# Altium project DHA-3v15.PrjPcb (part 2 of 3)

## Sheet PW.SchDoc
size A4; SheetNumber: 5; SheetTotal: 15
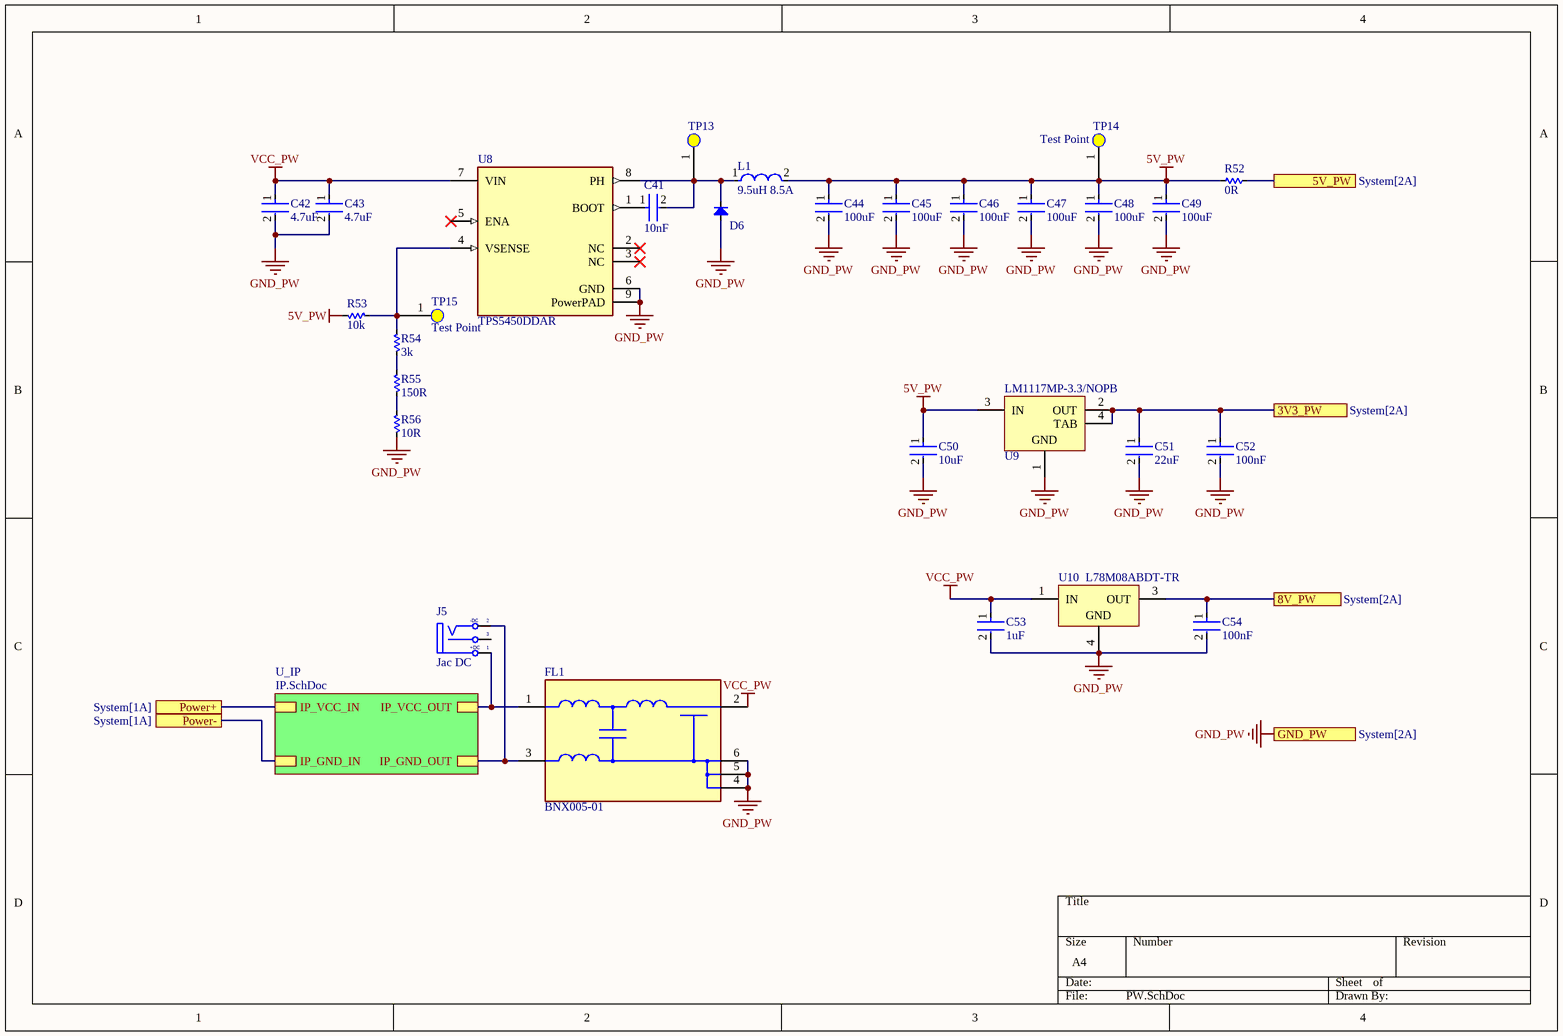
[diagram p6: PW.SchDoc]

### Parts
C41  10nF  [FP-GRM21B-0_1-IPC_A]
C42  4.7uF  [FP-C1210C107M9PACTU-IPC_A]
C43  4.7uF  [FP-C1210C107M9PACTU-IPC_A]
C44  100uF  [FP-C1210C107M9PACTU-IPC_A]
C45  100uF  [FP-C1210C107M9PACTU-IPC_A]
C46  100uF  [FP-C1210C107M9PACTU-IPC_A]
C47  100uF  [FP-C1210C107M9PACTU-IPC_A]
C48  100uF  [FP-C1210C107M9PACTU-IPC_A]
C49  100uF  [FP-C1210C107M9PACTU-IPC_A]
C50  10uF  [FP-GRM21B-0_15-MFG]
C51  22uF  [FP-GRM21B-0_15-MFG]
C52  100nF  [FP-GRM21B-0_15-MFG]
C53  1uF  [FP-C1206C-EB-MFG]
C54  100nF  [FP-C0603-CJ-MFG]
D6  SS54  [DIO-SMD-B]  (value not drawn)
FL1  BNX005-01  [FP-BNX_L12MM5_W11MM5_T13M-MFG]
J5  Jac DC  [DC0]
L1  9.5uH 8.5A  [CDEP147NP]
R52  0R  [RES-SMD-0805]
R53  10k  [RES-SMD-0603]
R54  3k  [RES-SMD-0603]
R55  150R  [RES-SMD-0603]
R56  10R  [RES-SMD-0603]
TP13  Test Point  [Test Point]  (value not drawn)
TP14  Test Point  [Test Point]
TP15  Test Point  [Test Point]
U8  TPS5450DDAR  [FP-DDA0008J-MFG]
U9  LM1117MP-3.3/NOPB  [DCY0004A_M]
U10  L78M08ABDT-TR  [TO-252_N]

### Sub-sheets
U_IP = IP.SchDoc: IP_VCC_OUT, IP_VCC_IN, IP_GND_IN, IP_GND_OUT

### Ports
3V3_PW (see System[2A]), 5V_PW (see System[2A]), 8V_PW (see System[2A]), GND_PW (see System[2A]), Power+ (see System[1A]), Power- (see System[1A])

### Nets
3V3: C51.1 C52.1 U9.2(OUT) U9.4(TAB) ; port 3V3_PW
5V: R52.1 ; port 5V_PW
5V_PW: C44.1 C45.1 C46.1 C47.1 C48.1 C49.1 C50.1 L1.2 R52.2 R53.1 TP14.1(Test_Point) U9.3(IN)
8V: C54.1 U10.3(OUT) ; port 8V_PW
GND_PW: C42.2 C43.2 C44.2 C45.2 C46.2 C47.2 C48.2 C49.2 C50.2 C51.2 C52.2 C53.2 C54.2 D6.1(A) FL1.4(CG) FL1.5(CG) FL1.6(CG) R56.2 U8.6(GND) U8.9(PowerPAD) U9.1(GND) U10.4(GND) ; port GND_PW  [project net GND]
Power+: port Power+, sheet U_IP/IP_VCC_IN
VCC_PW: C42.1 C43.1 C53.1 FL1.2(CB) U8.7(VIN) U10.1(IN)
NetC41_1: C41.1 U8.1(BOOT)
NetC41_2: C41.2 D6.2(K) L1.1 TP13.1(Test_Point) U8.8(PH)
NetC59_1: FL1.1(B) J5.1(T) ; sheet U_IP/IP_VCC_OUT
NetD20_1: FL1.3(PSG) J5.2(TN) ; port Power-, sheet U_IP/IP_GND_IN, sheet U_IP/IP_GND_OUT
NetR53_2: R53.2 R54.1 TP15.1(Test_Point) U8.4(VSENSE)
NetR54_2: R54.2 R55.1
NetR55_2: R55.2 R56.1

Not connected (* = marked no-connect by the designer): J5 3(S); U8 2(NC)* 3(NC)* 5(ENA)*

### Notes on the sheet
- (in symbol DCIN) -DC; +DC

### Library data of the parts
C41 = CMP-2007-03453-2: 0805 10NF 50V; Voltage Rating (DC): 16V; Dielectric: X5R; Tolerance: 10%; Capacitance: 10uF; Material: Ceramic; Radiation Hardening: No; Thickness: 0.053inch; Lead Free: Lead Free; Package Quantity: 1; Width: 1.25mm; Case Code (Imperial): 0805; Depth: 1.25mm; Packaging: Tape and Reel; Max Operating Temperature: 85°C; Voltage Rating: 16V; Voltage: 16V; Height: 1.25mm; Case Code (Metric): 2012; Mount: Surface Mount; Case/Package: 0805; REACH SVHC: No SVHC; Length: 2mm; Min Operating Temperature: -55°C; Termination: SMD/SMT
C42 C43 = CMP-2000-06018-2: Tụ 4.7uF 1210 50V 10%; Voltage Rating (DC): 6.3V; Capacitance: 100uF; Dissipation Factor: 5%; Dielectric: X5R; Dielectric Material: Ceramic; Tolerance: 20%; Termination: SMD/SMT; REACH SVHC: No SVHC; Thickness: 0.11inch; Packaging: Tape and Reel; Series: C; Width: 2.5mm; Voltage: 6.3V; Contact Plating: Tin; Package Quantity: 1; Case/Package: 1210; Min Operating Temperature: -55°C; Height: 2.5mm; Radiation Hardening: No; Case Code (Metric): 3225; Depth: 2.5mm; Construction: Flat; Max Operating Temperature: 85°C; Number of Pins: 2; Mount: Surface Mount; Lead Free: Lead Free; RoHS Compliant: Yes; Voltage Rating: 6.3V; Length: 3.2mm; Case Code (Imperial): 1210
  C42: ComponentLink1Description: New link; ComponentLink1URL: https://linhkien.cxtvn.com/3437-tu-1210-khong-phan-cuc.html
C44-C49 = CMP-2000-06018-2: SMD 1210 100UF 107K 3225 25V 20% X5R; Voltage Rating (DC): 6.3V; Dissipation Factor: 5%; Dielectric Material: Ceramic; Termination: SMD/SMT; REACH SVHC: No SVHC; Thickness: 0.11inch; Packaging: Tape and Reel; Series: C; Width: 2.5mm; Voltage: 6.3V; Contact Plating: Tin; Package Quantity: 1; Case/Package: 1210; Min Operating Temperature: -55°C; Height: 2.5mm; Radiation Hardening: No; Capacitance: 100uF; Case Code (Metric): 3225; Depth: 2.5mm; Construction: Flat; Max Operating Temperature: 85°C; Number of Pins: 2; Mount: Surface Mount; Lead Free: Lead Free; RoHS Compliant: Yes; Voltage Rating: 6.3V; Dielectric: X5R; Length: 3.2mm; Case Code (Imperial): 1210; Tolerance: 20%
  C44: ComponentLink1Description: New link; ComponentLink1URL: https://cungcaplinhkien.vn/tu-gom-smd-1210-100uf-107k-3225-25v-20-x5r
C50 C52 = CMP-2007-03385-2: Cap 0805 10%; Material: Ceramic; Voltage: 6.3V; Dielectric: X5R; Tolerance: 20%; Capacitance: 22uF; Max Operating Temperature: 85°C; Min Operating Temperature: -55°C; Case/Package: 0805; Thickness: 0.053inch; Packaging: Tape and Reel; Depth: 1.25mm; Termination: SMD/SMT; Voltage Rating (DC): 6.3V; Radiation Hardening: No; Mount: Surface Mount; Lead Free: Lead Free; Package Quantity: 1; REACH SVHC: No SVHC; Voltage Rating: 6.3V; Length: 2mm; Case Code (Imperial): 0805; Case Code (Metric): 2012; Width: 0.049inch; Height: 1.25mm
C51 = CMP-2007-03385-2: Cap 0805 10%; Material: Ceramic; Voltage: 6.3V; Dielectric: X5R; Tolerance: 20%; Max Operating Temperature: 85°C; Min Operating Temperature: -55°C; Case/Package: 0805; Thickness: 0.053inch; Packaging: Tape and Reel; Depth: 1.25mm; Termination: SMD/SMT; Voltage Rating (DC): 6.3V; Radiation Hardening: No; Mount: Surface Mount; Lead Free: Lead Free; Package Quantity: 1; REACH SVHC: No SVHC; Voltage Rating: 6.3V; Capacitance: 22uF; Length: 2mm; Case Code (Imperial): 0805; Case Code (Metric): 2012; Width: 0.049inch; Height: 1.25mm
C53 = CMP-03020-000153-1: CAP CER 0.1UF 100V X7R 1206; Manufacturer: KEMET; Manufacturer Part Number: C1206C104K1RACTU; Value: 0.10 μF; Tolerance: 0.1; Material: Ceramic; Temperature Coefficient: 15%; Automotive Grade: Grade 0; Voltage Rating: 100 V; Automotive: Yes; Ipc Land Pattern Name: CAPC320160X78; Device Class L1: Passive Components; ComponentLink2Description: Datasheet; Temperature Range Low: -55°C; Category: Cap; Octopart: https://octopart.com/c1206c104k1ractu-kemet-89521; Height: 0.88mm; Lead Free: Yes; Digikey Description: CAP CER 0.1UF 100V X7R 1206; Mouser Description: CAP CER 0.1UF 100V X7R 1206; Device Class L3: Ceramic Capacitors; Device Class L2: Capacitors; ComponentLink2URL: https://content.kemet.com/datasheets/KEM_C1007_X8R_ULTRA_150C_SMD.pdf; Temperature Range High: +150°C; Temperature Characteristic: X7R; RoHS: TRUE; Capacitance: 0.10 μF; Package: C1206C-EB; Temperature: -55°C to +150°C
C54 = CMP-2006-03300-2: CAP CER 0.1UF 50V X7R 0603; Manufacturer Part Number: C0603X104K5RACTU; Manufacturer: Kemet; Material: Ceramic; Tolerance: 10%; Temperature Coefficient: 15%; Temperature Range High: +125°C; Temperature Range Low: -55°C; Voltage: 50V; ComponentLink2Description: Datasheet; RoHS: TRUE; ComponentLink2URL: https://content.kemet.com/datasheets/KEM_C1013_X7R_FT-CAP_SMD.pdf; Capacitance: 100nF; Device Class L3: Ceramic Capacitors; Device Class L2: Capacitors; Package: C0603-CJ; Height: 0.95mm; Device Class L1: Passive Components; Temperature Characteristic: X7R; Lead Free: Yes; Digikey Description: CAP CER 0.1UF 50V X7R 0603; Automotive: No; Value: 100nF; Mouser Description: Capacitor; Ceramic; Cap 0.1uF; Tol+10%; SMT; Flexible Termination; Vol-Rtg 50V; TR; Temperature: -55°C to +125°C; Octopart: https://octopart.com/c0603x104k5ractu-kemet-9145062; Category: Cap; Voltage Rating: 50V; Ipc Land Pattern Name: CAPC16080X80
D6 = Diode SMD: SMB; Code - JEDEC: DO-214-AB; Value: 1N5007; Published: 8-Jun-2000; Revision: July-2002: Re-released for DXP Platform.; Publisher: Altium Limited
FL1 = CMP-06051-000064-1: BNX005-01 FILTER LC TH 12x11mm; Max Current Rating: 15A; Voltage Rating: 50V; Number of Channels: 2; Attenuation Value: 40dB; Frequency: 1GHz; Impedance: 50R; Shielding: Unshielded; ESD Protection: No; Height: 13.5mm; Circuit Type: Filter; Package Quantity: 100; Radiation Hardening: No; Max Operating Temperature: 85°C; Packaging: Bulk; Current Rating: 15A; Width: 11mm; REACH SVHC: No SVHC; Mount: Through Hole; Depth: 11mm; Termination: PC Pins; Current: 15A; Contact Plating: Copper; Min Operating Temperature: -30°C; Max Voltage Rating (DC): 50V; Length: 12mm; Lead Free: Lead Free; ComponentLink1Description: New link; ComponentLink1URL: https://linhkien.cxtvn.com/10042-bnx005-01-filter-lc-th-12x11mm.html
J5 = DCIN: Jac DC input; Value: Jac DC
L1 = CDEP147NP: CEPD147NP-9R5MC Cuộn cảm 9.5uH 8.5A 14.5x14.5x8mm; ComponentLink1Description: New link; ComponentLink1URL: https://linhkien.cxtvn.com/10665-cepd147np-9r5mc-cuon-cam-95uh-85a-145x145x8mm.html
R52 = Res-SMD: Res 0805 1%; Manufacturer: Generic Components; Class: Passive; Published: 08/06/2000; Publisher: Altium Hobart Technology Centre
R53-R56 = Res-SMD: Res 0603 5%; Manufacturer: Generic Components; Class: Passive; Published: 08/06/2000; Publisher: Altium Hobart Technology Centre
U8 = CMP-04918-000100-1: TPS5450DDAR IC Reg Buck Adjustable 5A 8-PowerSOIC; Manufacturer: Texas Instruments; Output Type: AdjustableProgrammable; Output Voltage: 1.22-31V; Max Duty Cycle: 89%; Min Supply Voltage: 5.5V; Standoff Height: 0mm; Max Junction Temp: +125°C; Max Supply Voltage: 36V; Nominal Supply Current: 3mA; Number Of Outputs: 1; Switching Frequency: 500kHz; Device Class L3: Voltage Regulators - Switching; Octopart: https://octopart.com/tps5450ddar-texas+instruments-7105511; Temperature: -40°C to +125°C; Mouser Description: Conv DC-DC 5.5V to 36V Step Down Single-Out 1.22V to 31V 5A 8-Pin HSOP EP T/R; Device Class L1: Integrated Circuits (ICs); Automotive: No; Package: DDA0008J; Temperature Range Low: -40°C; RoHS: TRUE; Digikey Description: IC REG BUCK ADJUSTABLE 5A 8SOPWR; Lead Free: Yes; Manufacturer Part Number: TPS5450DDAR; Device Class L2: Power Management ICs; Temperature Range High: +125°C; Output Current: 5A; Height: 1.7mm; Ipc Land Pattern Name: SOIC127P600X170-8; Category: IC; Switching Topology: Buck; ComponentLink3Description: New link; ComponentLink3URL: https://linhkien.cxtvn.com/5009-tps5450ddar-ic-reg-buck-adjustable-5a-8-powersoic.html
U9 = CMP-0062-01638-4: 800mA Low-Dropout Linear Regulator, 4-pin SOT-223, Pb-Free; Manufacturer: Texas Instruments; CompType: LDO IC; PackageTopMarking: XYTT*N05A; High-Reliability: Y; PowerWise: N; ComponentLink1URL: http://www.ti.com/general/docs/lit/getliterature.tsp?genericPartNumber=LM1117-N&fileType=pdf; PinCount: 4; PackageDescription: Molded SOT-223, 6.50 x 3.56 x 1.6mm Body, 4 Lead, 2.3mm Pitch; Code_IPC: SOT223-4; PartNumber: LM1117MP-3.3/NOPB; Code_JEDEC: TO-261-AA; RoHS: Y; PackageReference: DCY0004A; ComponentLink1Description: Datasheet URL
U10 = CMP-0244-00195-1: Precision 500mA Regulator, 8V, 3-Pin DPAK, Tape and Reel; PackageVersion: 2011; ComponentLink1URL: http://www.st.com; ComponentLink1Description: Manufacturer URL; PackageDescription: 3-Pin Transistor Outline Package 2.28 mm Pitch, 9.7 mm Lead Span (DPAK); ComponentLink2URL: http://www.st.com/internet/com/TECHNICAL_RESOURCES/TECHNICAL_LITERATURE/DATASHEET/CD00000448.pdf; DatasheetVersion: 1/11/2010; PackageReference: TO-252; ComponentLink2Description: Datasheet

## Sheet IP.SchDoc
size A4; SheetNumber: 6; SheetTotal: 14
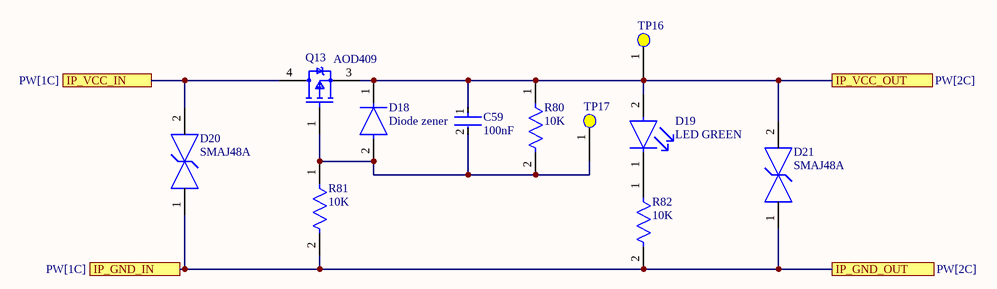
[diagram p7: IP.SchDoc]

### Parts
C59  100nF  [FP-GRM18-0_15-MFG]
D18  Diode zener  [FP-DO-213AA-MFG]
D19  LED GREEN  [FP-LTST-C190GKT-MFG]
D20  SMAJ48A  [FP-SMAJ-MFG]
D21  SMAJ48A  [FP-SMAJ-MFG]
Q13  AOD409  [FP-PG-TO252-3-MFG]
R80  10K  [FP-RC0603-0_55-IPC_A]
R81  10K  [FP-RC0603-0_55-IPC_C]
R82  10K  [FP-RC0603-0_55-IPC_C]
TP16  Test Point  [Test Point]  (value not drawn)
TP17  Test Point  [Test Point]  (value not drawn)

### Ports
IP_GND_IN (see PW[1C]), IP_GND_OUT (see PW[2C]), IP_VCC_IN (see PW[1C]), IP_VCC_OUT (see PW[2C])

### Nets
Power+: D20.2 Q13.4(D) ; port IP_VCC_IN
NetC59_1: C59.1 D18.1(C) D19.2(A) D21.2 Q13.3(S) R80.1 TP16.1(Test_Point) ; port IP_VCC_OUT
NetC59_2: C59.2 D18.2(A) Q13.1(G) R80.2 R81.1 TP17.1(Test_Point)
NetD19_1: D19.1(C) R82.1
NetD20_1: D20.1 D21.1 R81.2 R82.2 ; port IP_GND_IN, port IP_GND_OUT

### Library data of the parts
C59 = CMP-2000-05448-2: CAP CER 10V X5R 0603; Manufacturer Part Number: GRM188R61A106KE69D; Manufacturer: Murata; Temperature Coefficient: 15%; Value: 10uF; Material: Ceramic; Tolerance: 10%; Device Class L1: Passive Components; ComponentLink2Description: Datasheet; Height: 0.95mm; Package: GRM18-0.15; Octopart: https://octopart.com/grm188r61a106ke69d-murata-22851381; Digikey Description: CAP CER 10UF 10V X5R 0603; Temperature Range High: +85°C; Temperature Range Low: -55°C; Temperature Characteristic: X5R; Capacitance: 10uF; RoHS: TRUE; Device Class L2: Capacitors; ComponentLink2URL: https://search.murata.co.jp/Ceramy/image/img/A01X/G101/ENG/GRM188R61A106KE69-01A.pdf; Device Class L3: Ceramic Capacitors; Lead Free: Yes; Mouser Description: Multilayer Ceramic Capacitors MLCC - SMD/SMT 0603 10uF 10volts X5R + - 10%; Category: Cap; Voltage Rating: 10V; Temperature: -55°C to +85°C; Automotive: No
D18 = CMP-2000-07607-2: ZMM12 Diode zener 0.5W 12V SOD-80(1206); Manufacturer Part Number: JANTX1N4148UR-1; Manufacturer: Microsemi; Max Junction Temp: +175°C; Max Repetitive Reverse Voltage: 75V; Value: 4pF; Reverse Voltage: 100V; Forward Current: 200mA; Max Surge Forward Current: 2A; Temperature: -65°C to +175°C; Device Class L2: Diodes; Capacitance: 4pF; Octopart: https://octopart.com/jantx1n4148ur-1-microsemi-6804654; Height: 1.7mm; Automotive: No; Digikey Description: DIODE GEN PURP 75V 200MA DO213AA; Device Class L1: Discrete Semiconductors; Package: DO-213AA; Category: Diode; ComponentLink2URL: https://www.microsemi.com/document-portal/doc_download/125215-lds-0281-1-datasheet; Device Class L3: Rectifier Diodes; Temperature Range Low: -65°C; Temperature Range High: +175°C; Mouser Description: Diodes - General Purpose, Power, Switching Switching; RoHS: FALSE; Lead Free: No; ComponentLink2Description: Datasheet
D19 = CMP-22017-000005-2: LED GREEN CLEAR CHIP SMD; Dominant Wavelength: 569nm; Reverse Voltage: 5V; Lens Color: Colorless; Viewing Angle: 130°; Voltage: 2V; Forward Current: 30mA; Power Dissipation: 100mW; Luminous Intensity: 6mcd; Number of LEDs: 1; Forward Voltage: 2.1V; Wavelength: 565nm; Test Current: 10mA; Min Operating Temperature: -55°C; Lens Style: Clear; Mount: Surface Mount; Width: 0.8mm; Packaging: Tape and Reel; Lens Transparency: Clear; Case Code (Metric): 1608; Depth: 0.8mm; Case Code (Imperial): 0603; Case/Package: 0603; Number of Pins: 2; Max Operating Temperature: 85°C; Lead Free: Lead Free; Number of Elements: 1; Length: 1.6mm; Height: 0.8mm; Package Quantity: 1; Power Rating: 100mW; Radiation Hardening: No; Illumination Color: Green; Color: Green
D20 D21 = CMP-08607-000067-1: SMAJ48A TVS DIODE 48VWM 77.4VC DO214AC (SMA); Manufacturer: Littelfuse Inc; Manufacturer Part Number: SMAJ58CA; Reverse Standoff Voltage: 58V; Breakdown Voltage: 64.4V; Peak Pulse Current: 4.3A; Peak Pulse Power: 400W; Direction: Bidirectional; Clamping Voltage: 93.6V; Number Of Channels: 1; Max Junction Temp: +150°C; Device Class L2: TVS Diodes; ComponentLink2Description: Datasheet; Lead Free: Yes; Height: 2.29mm; Automotive: No; Package: SMAJ; Digikey Description: TVS DIODE 58V 93.6V DO214AC; Temperature Range Low: -65°C; Device Class L1: Circuit Protection; Temperature Range High: +150°C; Mouser Description: In a Pack of 25, Littelfuse SMAJ58CA, Bi-Directional TVS Diode, 400W, 2-Pin DO-214AC; Octopart: https://octopart.com/smaj58ca-littelfuse-350202; ComponentLink2URL: https://www.littelfuse.com/~/media/electronics/datasheets/tvs_diodes/littelfuse_tvs_diode_smaj_datasheet.pdf.pdf; Temperature: -65°C to +150°C; Device Class L3: unset; Category: Diode; RoHS: TRUE
Q13 = CMP-32901-000090-1: AOD409 MOSFET P-CH 60V 26A TO252; Manufacturer: Infineon; Manufacturer Part Number: IRFR5410TRPBF; Threshold Vgs Min: -2V; Pulse Drain Current: -52A; Max Junction Temp: +150°C; Drain To Source Voltage: -100V; Max Forward Diode Voltage: -1.6V; Power Dissipation: 66W; Turn On Delay Time: 15ns; Input Capacitace At Vds: 760pF @ -25V; Rthja Max: 50°C/W; Depletion Mode: False; Number Of P Channels: 1; Reverse Recovery Time: 130ns; Continuous Drain Current: -13A; Drain To Source Resistance: 0.205Ω; Threshold Vgs Max: -4V; Reverse Recovery Charge: 650nC; Gate To Source Voltage: 20V; Gate Charge At Vgs: 58nC @ -10V; Turn Off Delay Time: 45ns; Temperature: -55°C to +150°C; Package: PG-TO252-3; Category: Trans; Footprint Url: http://www.irf.com/package/hexfet/dpakfootprint.pdf; Temperature Range Low: -55°C; Temperature Range High: +150°C; Automotive: No; Device Class L3: MOSFETs; Digikey Description: MOSFET P-CH 100V 13A DPAK; ComponentLink2URL: https://www.infineon.com/dgdl/irfr5410pbf.pdf?fileId=5546d462533600a4015356356f622107; Octopart: https://octopart.com/irfr5410trpbf-infineon-65874169; Device Class L2: Transistors; Lead Free: Yes; ComponentLink2Description: Datasheet; Height: 2.52mm; Number Of Channels: 1; Drain To Source Breakdown Voltage: -100V; Device Class L1: Discrete Semiconductors; RoHS: TRUE
R80-R82 = CMP-2100-03664-2: RES 10K OHM 1% 1/10W 0603; Voltage Rating: 75V; Voltage Rating (DC): 50V; Resistance: 10kR; Power Rating: 100mW; Temperature Coefficient: 100ppm/°C; Depth: 0.8mm; Termination: SMD/SMT; Resistor Type: Thick Film; Series: RC; Construction: Rectangular; Features: Moisture Resistant; Packaging: Tape and Reel; Min Operating Temperature: -55°C; Number of Terminations: 2; Lead Pitch: 0.3mm; RoHS Compliant: Yes; Case/Package: 0603; Resistance Tolerance: 1%; Military Standard: Not; Weight: 7.1E-05oz; Number of Pins: 2; Tolerance: 1%; Length: 1.6mm; Case Code (Imperial): 0603; Lead Free: Lead Free; Width: 0.8mm; Max Power Dissipation: 100mW; Height: 0.45mm; Max Operating Temperature: 155°C; Case Code (Metric): 1608; Size Code: 0603

## Sheet SIM.SchDoc
size A3; SheetNumber: 12; SheetTotal: 15
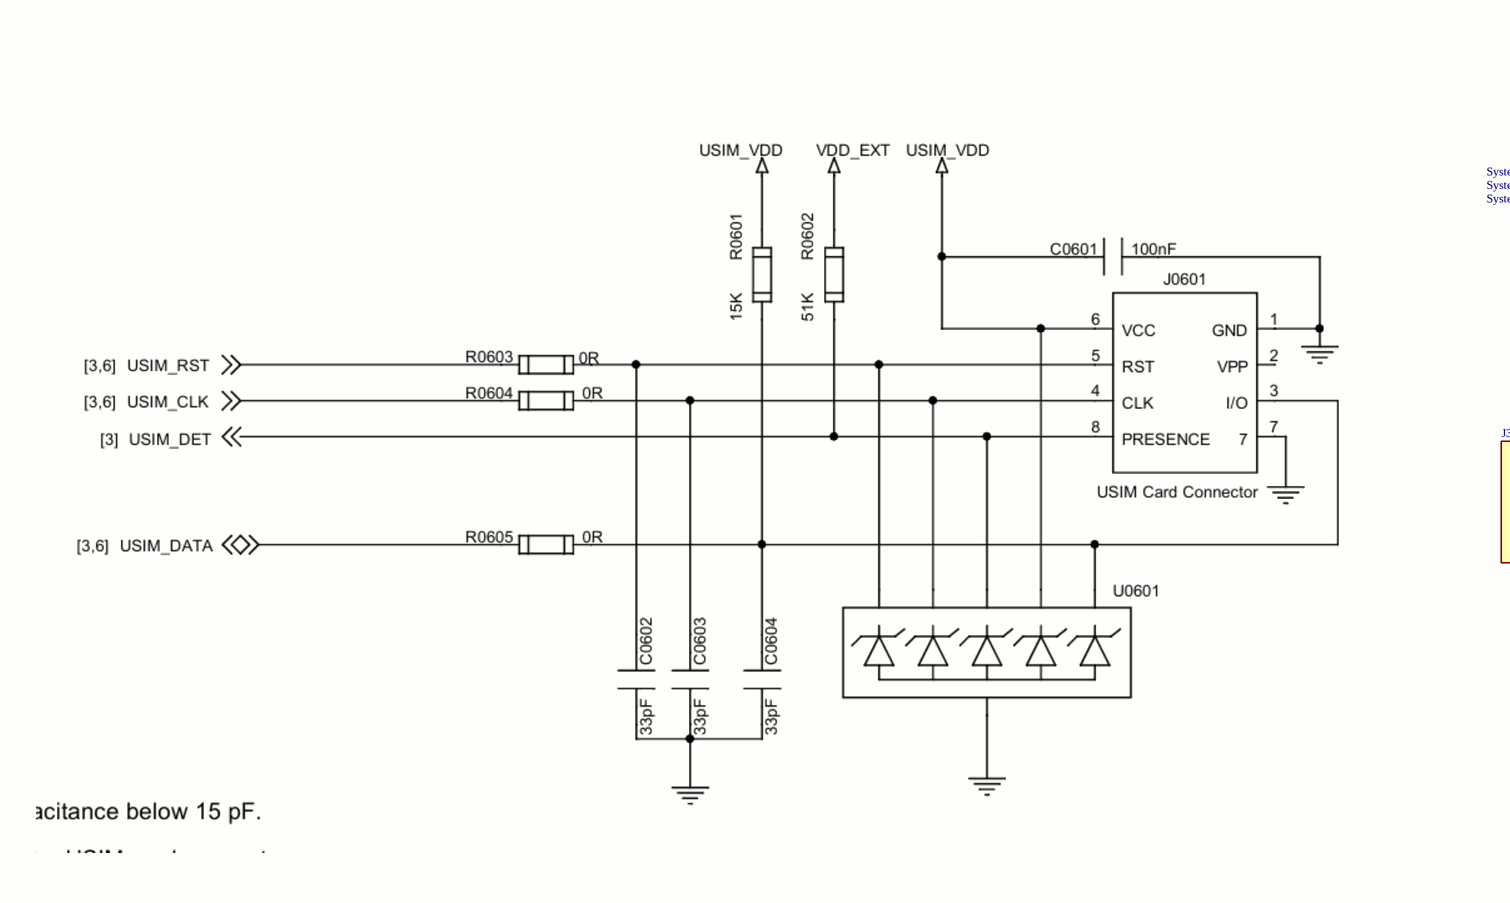
[diagram p8: SIM.SchDoc, top left]
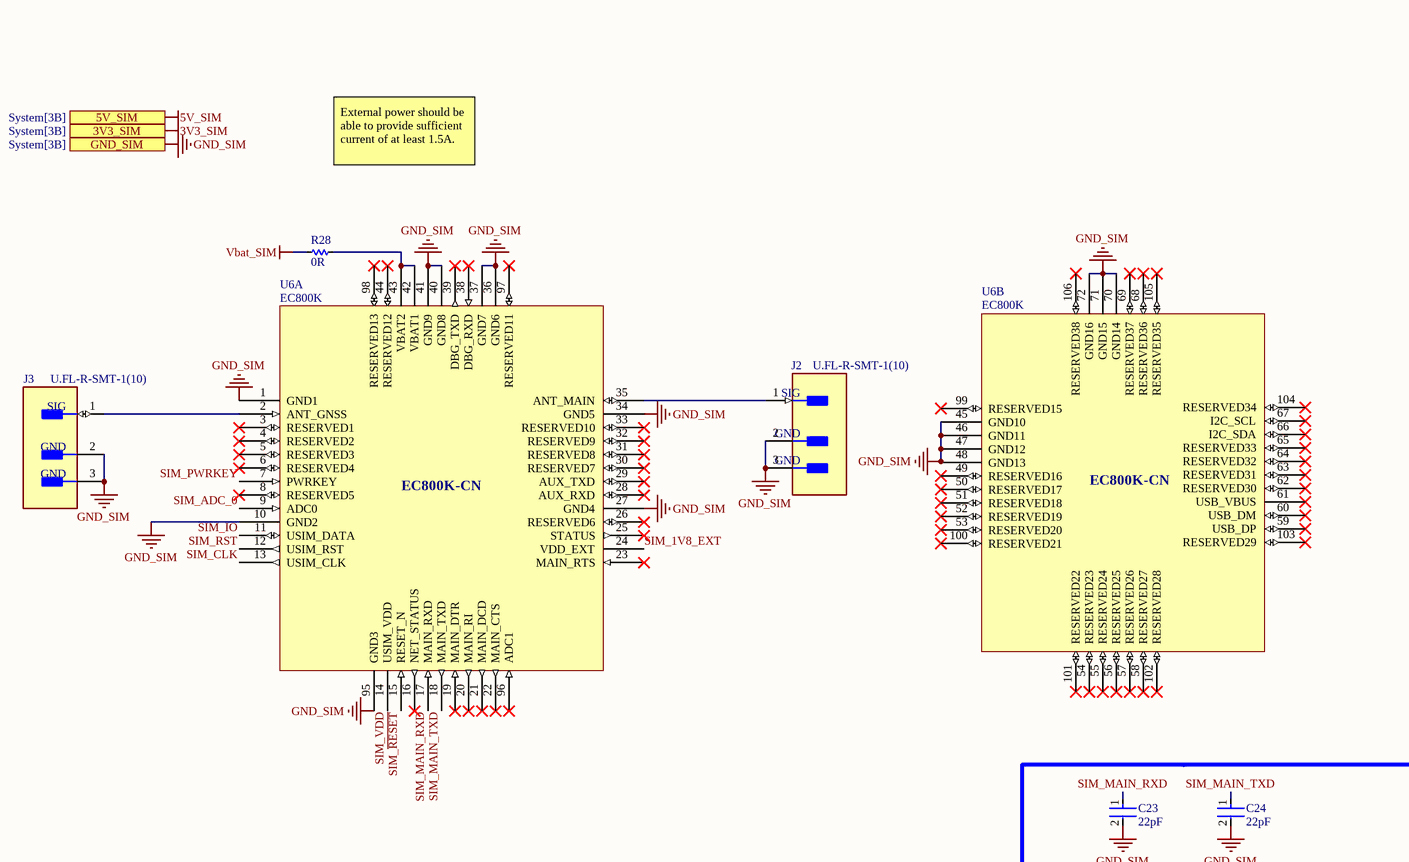
[diagram p9: SIM.SchDoc, top middle]
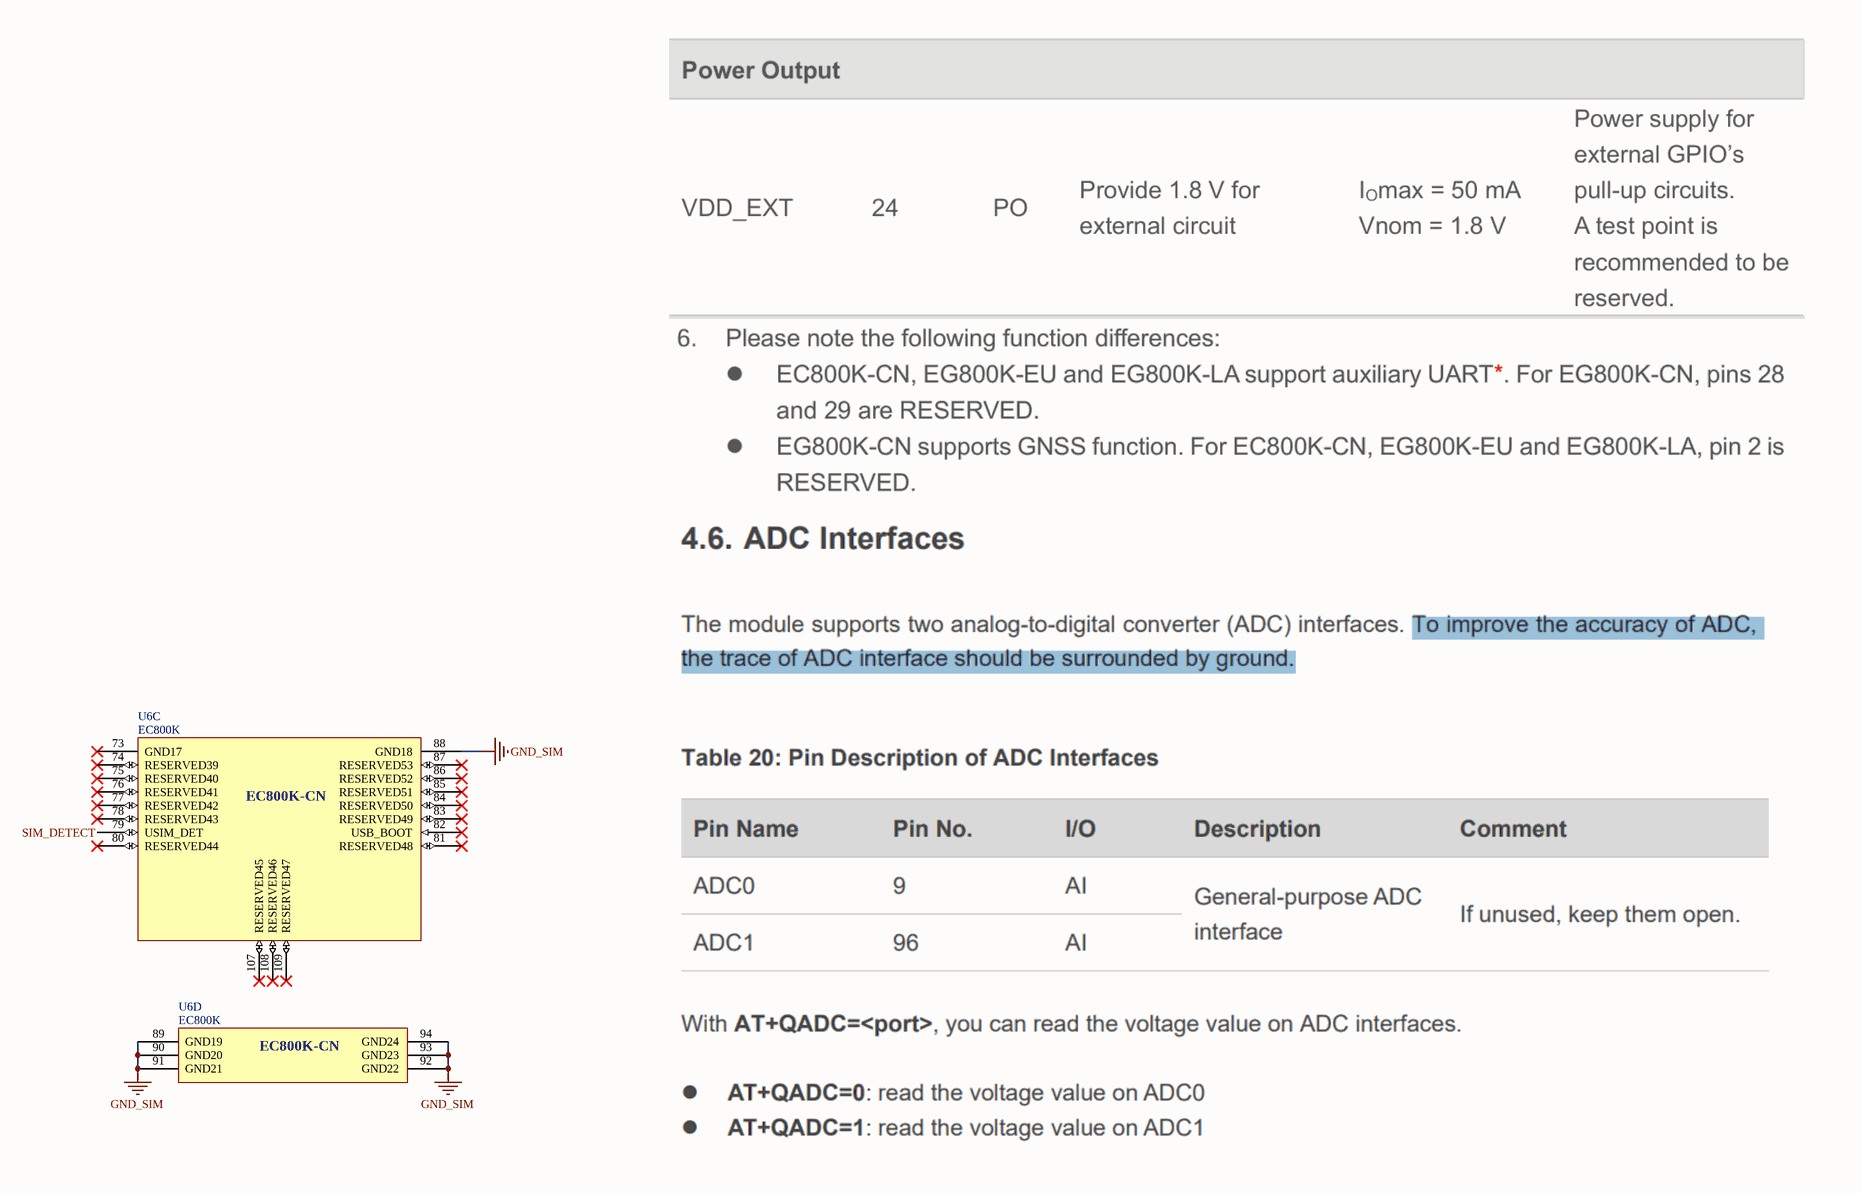
[diagram p10: SIM.SchDoc, top right]
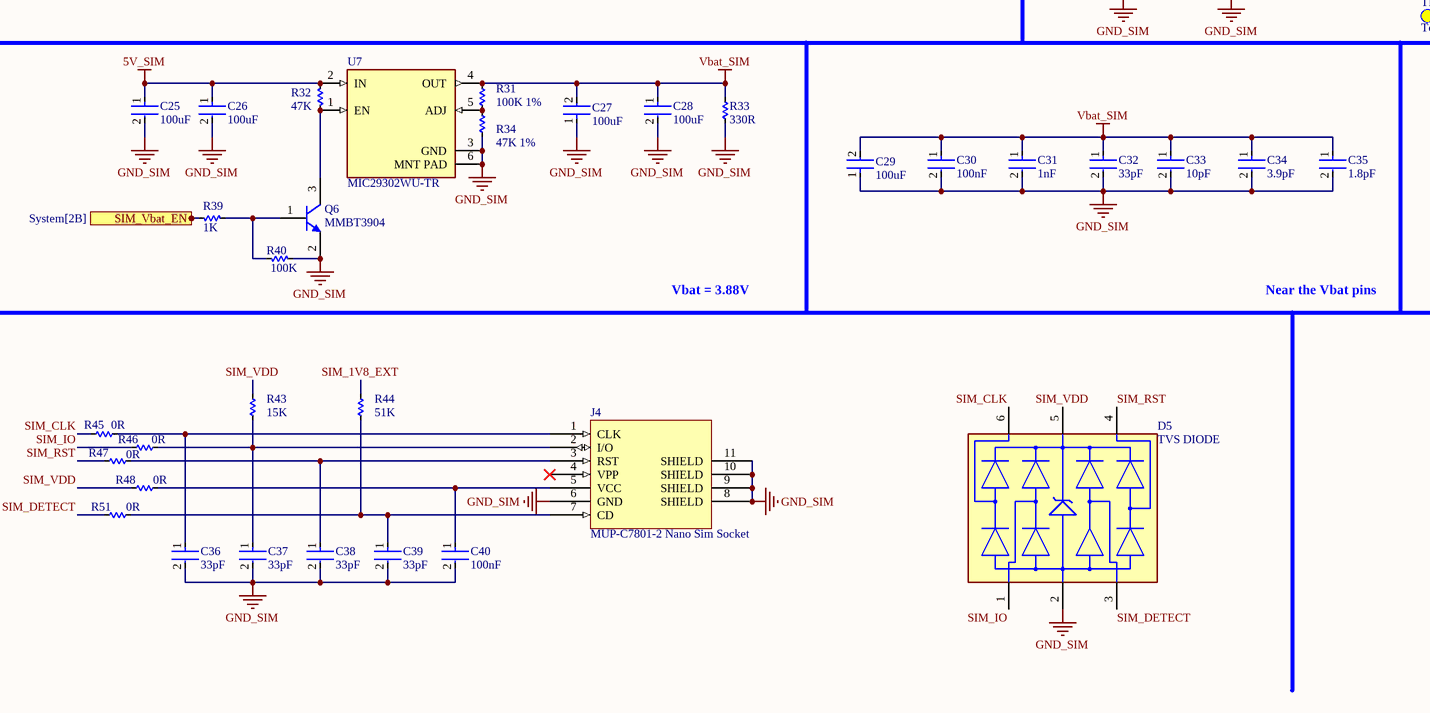
[diagram p11: SIM.SchDoc, bottom middle]
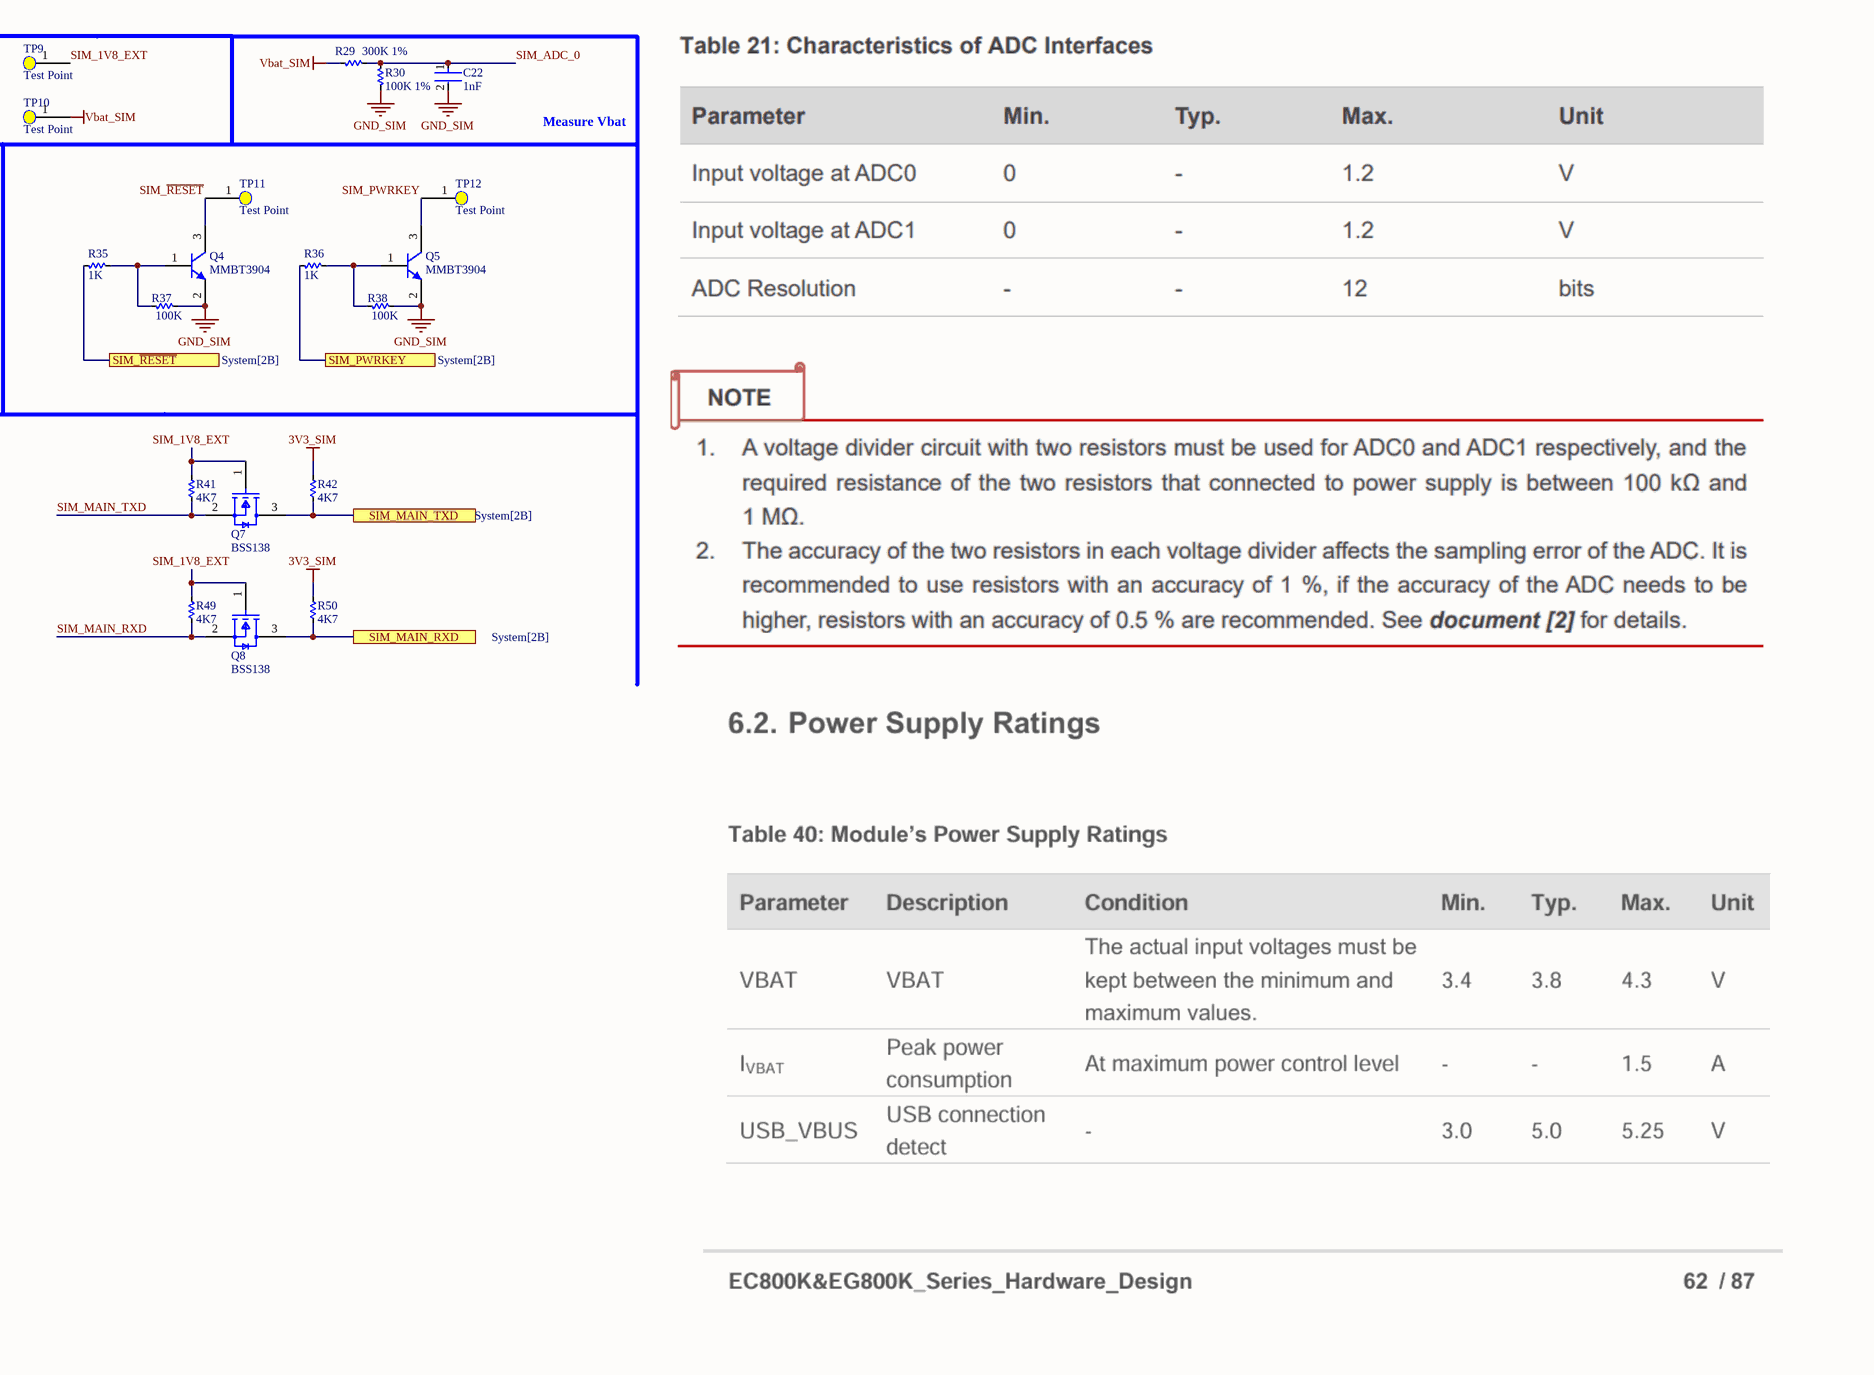
[diagram p12: SIM.SchDoc, bottom right]

### Parts
C22  1nF  [FP-GRM18-0_15-MFG]
C23  22pF  [FP-GRM188-0_1-e0_2_0_55-IPC_C]
C24  22pF  [FP-GRM188-0_1-e0_2_0_55-IPC_C]
C25  100uF  [FP-C1210C107M9PACTU-IPC_A]
C26  100uF  [FP-C1210C107M9PACTU-IPC_A]
C27  100uF  [FP-C1210C107M9PACTU-IPC_A]
C28  100uF  [FP-C1210C107M9PACTU-IPC_A]
C29  100uF  [FP-C1210C107M9PACTU-IPC_A]
C30  100nF  [FP-GRM188-0_1-e0_2_0_55-IPC_C]
C31  1nF  [FP-GRM188-0_1-e0_2_0_55-IPC_C]
C32  33pF  [FP-GRM188-0_1-e0_2_0_55-IPC_C]
C33  10pF  [FP-GRM188-0_1-e0_2_0_55-IPC_C]
C34  3.9pF  [FP-GRM188-0_1-e0_2_0_55-IPC_C]
C35  1.8pF  [FP-GRM188-0_1-e0_2_0_55-IPC_C]
C36  33pF  [FP-GRM188-0_1-e0_2_0_55-IPC_C]
C37  33pF  [FP-GRM188-0_1-e0_2_0_55-IPC_C]
C38  33pF  [FP-GRM188-0_1-e0_2_0_55-IPC_C]
C39  33pF  [FP-GRM188-0_1-e0_2_0_55-IPC_C]
C40  100nF  [FP-GRM188-0_1-e0_2_0_55-IPC_C]
D5  TVS DIODE  [FP-318G-02-MFG]
J2  U.FL-R-SMT-1(10)  [FP-U_FL-R-SMT-1_10-MFG]
J3  U.FL-R-SMT-1(10)  [FP-U_FL-R-SMT-1_10-MFG]
J4  MUP-C7801-2 Nano Sim Socket  [MCP-C7801-2]
Q4  MMBT3904  [FAIR-SOT23-3_V]
Q5  MMBT3904  [FAIR-SOT23-3_V]
Q6  MMBT3904  [FAIR-SOT23-3_V]
Q7  BSS138  [FP-318-08-IPC_B]
Q8  BSS138  [FP-318-08-IPC_B]
R28  0R  [RES-SMD-0805]
R29  300K 1%  [RES-SMD-0603]
R30  100K 1%  [RES-SMD-0603]
R31  100K 1%  [RES-SMD-0603]
R32  47K  [RES-SMD-0603]
R33  330R  [RES-SMD-0603]
R34  47K 1%  [RES-SMD-0603]
R35  1K  [RES-SMD-0603]
R36  1K  [RES-SMD-0603]
R37  100K  [RES-SMD-0603]
R38  100K  [RES-SMD-0603]
R39  1K  [RES-SMD-0603]
R40  100K  [RES-SMD-0603]
R41  4K7  [RES-SMD-0603]
R42  4K7  [RES-SMD-0603]
R43  15K  [RES-SMD-0603]
R44  51K  [RES-SMD-0603]
R45  0R  [RES-SMD-0603]
R46  0R  [RES-SMD-0603]
R47  0R  [RES-SMD-0603]
R48  0R  [RES-SMD-0603]
R49  4K7  [RES-SMD-0603]
R50  4K7  [RES-SMD-0603]
R51  0R  [RES-SMD-0603]
TP9  Test Point  [Test Point]
TP10  Test Point  [Test Point]
TP11  Test Point  [Test Point]
TP12  Test Point  [Test Point]
U6  EC800K  [EC800K]  (parts A,B,C,D of 4)
U7  MIC29302WU-TR  [FP-C04-012-MFG]

### Ports
3V3_SIM (see System[3B]), 5V_SIM (see System[3B]), GND_SIM (see System[3B]), SIM_MAIN_RXD (see System[2B]), SIM_MAIN_TXD (see System[2B]), SIM_PWRKEY (see System[2B]), SIM_Vbat_EN (see System[2B]), SIM_~{RESET} (see System[2B])

### Nets
3V3_SIM: R42.1 R50.1 ; port 3V3_SIM  [project net 3V3]
5V_SIM: C25.1 C26.1 R32.2 U7.2(IN) ; port 5V_SIM  [project net 5V]
GND_SIM: C22.2 C23.2 C24.2 C25.2 C26.2 C27.1 C28.2 C29.1 C30.2 C31.2 C32.2 C33.2 C34.2 C35.2 C36.2 C37.2 C38.2 C39.2 C40.2 D5.2(VN) J2.2(GND) J2.3(GND) J3.2(GND) J3.3(GND) J4.6(GND) J4.8(SHIELD) J4.9(SHIELD) J4.10(SHIELD) J4.11(SHIELD) Q4.2(E) Q5.2(E) Q6.2(E) R30.2 R33.2 R34.2 R37.1 R38.1 R40.1 U6.1(GND1) U6.10(GND2) U6.27(GND4) U6.34(GND5) U6.36(GND6) U6.37(GND7) U6.40(GND8) U6.41(GND9) U6.45(GND10) U6.46(GND11) U6.47(GND12) U6.48(GND13) U6.70(GND14) U6.71(GND15) U6.72(GND16) U6.88(GND18) U6.89(GND19) U6.90(GND20) U6.91(GND21) U6.92(GND22) U6.93(GND23) U6.94(GND24) U6.95(GND3) U7.3(GND) U7.6(MNT_PAD) ; port GND_SIM  [project net GND]
Vbat_SIM: C27.2 C28.1 C29.2 C30.1 C31.1 C32.1 C33.1 C34.1 C35.1 R28.2 R29.1 R31.2 R33.1 TP10.1(Test_Point) U7.4(OUT)
SIM_1V8_EXT: Q7.1(G) Q8.1(G) R41.1 R44.1 R49.1 TP9.1(Test_Point) U6.24(VDD_EXT)
SIM_ADC_0: C22.1 R29.2 R30.1 U6.9(ADC0)
SIM_CLK: D5.6(4_I/O) R45.2 U6.13(USIM_CLK)
SIM_DETECT: D5.3(2_I/O) R51.2 U6.79(USIM_DET)
SIM_IO: D5.1(1_I/O) R46.2 U6.11(USIM_DATA)
SIM_MAIN_RXD: C23.1 Q8.2(S) R49.2 U6.17(MAIN_RXD)
SIM_MAIN_TXD: C24.1 Q7.2(S) R41.2 U6.18(MAIN_TXD)
SIM_PWRKEY: Q5.3(C) TP12.1(Test_Point) U6.7(PWRKEY)
SIM_~{RESET}: Q4.3(C) TP11.1(Test_Point) U6.15(RESET_N)
SIM_RST: D5.4(3_I/O) R47.2 U6.12(USIM_RST)
SIM_VDD: D5.5(VP) R43.1 R48.2 U6.14(USIM_VDD)
NetC36_1: C36.1 J4.1(CLK) R45.1
NetC37_1: C37.1 J4.2(I/O) R43.2 R46.1
NetC38_1: C38.1 J4.3(RST) R47.1
NetC39_1: C39.1 J4.7(CD) R44.2 R51.1
NetC40_1: C40.1 J4.5(VCC) R48.1
NetJ2_1: J2.1(SIG) U6.35(ANT_MAIN)
NetJ3_1: J3.1(SIG) U6.2(ANT_GNSS)
NetQ4_1: Q4.1(B) R35.1 R37.2
NetQ5_1: Q5.1(B) R36.1 R38.2
NetQ6_1: Q6.1(B) R39.1 R40.2
NetQ6_3: Q6.3(C) R32.1 U7.1(EN)
NetQ7_3: Q7.3(D) R42.2 ; port SIM_MAIN_TXD
NetQ8_3: Q8.3(D) R50.2 ; port SIM_MAIN_RXD
NetR28_1: R28.1 U6.42(VBAT1) U6.43(VBAT2)
NetR31_1: R31.1 R34.1 U7.5(ADJ)
NetR35_2: R35.2 ; port SIM_~{RESET}
NetR36_2: R36.2 ; port SIM_PWRKEY
NetR39_2: R39.2 ; port SIM_Vbat_EN

Not connected (* = marked no-connect by the designer): J4 4(VPP)*; U6 3(RESERVED1)* 4(RESERVED2)* 5(RESERVED3)* 6(RESERVED4)* 8(RESERVED5)* 16(NET_STATUS)* 19(MAIN_DTR)* 20(MAIN_RI)* 21(MAIN_DCD)* 22(MAIN_CTS)* 23(MAIN_RTS)* 25(STATUS)* 26(RESERVED6)* 28(AUX_RXD)* 29(AUX_TXD)* 30(RESERVED7)* 31(RESERVED8)* 32(RESERVED9)* 33(RESERVED10)* 38(DBG_RXD)* 39(DBG_TXD)* 44(RESERVED12)* 49(RESERVED16)* 50(RESERVED17)* 51(RESERVED18)* 52(RESERVED19)* 53(RESERVED20)* 54(RESERVED23)* 55(RESERVED24)* 56(RESERVED25)* 57(RESERVED26)* 58(RESERVED27)* 59(USB_DP)* 60(USB_DM)* 61(USB_VBUS)* 62(RESERVED30)* 63(RESERVED31)* 64(RESERVED32)* 65(RESERVED33)* 66(I2C_SDA)* 67(I2C_SCL)* 68(RESERVED36)* 69(RESERVED37)* 73(GND17)* 74(RESERVED39)* 75(RESERVED40)* 76(RESERVED41)* 77(RESERVED42)* 78(RESERVED43)* 80(RESERVED44)* 81(RESERVED48)* 82(USB_BOOT)* 83(RESERVED49)* 84(RESERVED50)* 85(RESERVED51)* 86(RESERVED52)* 87(RESERVED53)* 96(ADC1)* 97(RESERVED11)* 98(RESERVED13)* 99(RESERVED15)* 100(RESERVED21)* 101(RESERVED22)* 102(RESERVED28)* 103(RESERVED29)* 104(RESERVED34)* 105(RESERVED35)* 106(RESERVED38)* 107(RESERVED45)* 108(RESERVED46)* 109(RESERVED47)*

### Notes on the sheet
- External power should be able to provide sufficient current of at least 1.5A.
- Measure Vbat
- Vbat = 3.88V
- Near the Vbat pins
- (in symbol EC800K, part A) EC800K-CN
- (in symbol EC800K, part B) EC800K-CN
- (in symbol EC800K, part C) EC800K-CN
- (in symbol EC800K, part D) EC800K-CN

### Library data of the parts
C22 = CMP-2000-05448-2: as C59 on sheet IP; Device Class L1: Passive Components; ComponentLink2Description: Datasheet; Height: 0.95mm; Package: GRM18-0.15; Octopart: https://octopart.com/grm188r61a106ke69d-murata-22851381; Digikey Description: CAP CER 10UF 10V X5R 0603; Temperature Range High: +85°C; Temperature Range Low: -55°C; Temperature Characteristic: X5R; Capacitance: 10uF; RoHS: TRUE; Device Class L2: Capacitors; ComponentLink2URL: https://search.murata.co.jp/Ceramy/image/img/A01X/G101/ENG/GRM188R61A106KE69-01A.pdf; Device Class L3: Ceramic Capacitors; Lead Free: Yes; Mouser Description: Multilayer Ceramic Capacitors MLCC - SMD/SMT 0603 10uF 10volts X5R + - 10%; Category: Cap; Voltage Rating: 10V; Temperature: -55°C to +85°C; Automotive: No
C23 C24 C30-C40 = CMP-2006-02792-2: Chip Multilayer Ceramic Capacitors for General Purpose, 0603, 10uF, X5R, 15%, 20%, 6.3V; Packaging: Tape and Reel; Voltage Rating (DC): 6.3V; Width: 0.031inch; Termination: SMD/SMT; Dielectric: X5R; Package Quantity: 4000; Voltage Rating: 6.3V; Capacitance: 10uF; Case/Package: 0603; Min Operating Temperature: -55°C; Voltage: 6.3V; Length: 1.6mm; Thickness: 0.035inch; Lead Free: Lead Free; Depth: 0.8mm; Case Code (Imperial): 0603; Max Operating Temperature: 85°C; Material: Ceramic; Height: 0.8mm; Tolerance: 20%; Mount: Surface Mount; REACH SVHC: No SVHC; Radiation Hardening: No; Case Code (Metric): 1608
C25-C29 = CMP-2000-06018-2: as C44 on sheet PW; Termination: SMD/SMT; REACH SVHC: No SVHC; Thickness: 0.11inch; Packaging: Tape and Reel; Series: C; Width: 2.5mm; Voltage: 6.3V; Contact Plating: Tin; Package Quantity: 1; Case/Package: 1210; Min Operating Temperature: -55°C; Height: 2.5mm; Radiation Hardening: No; Capacitance: 100uF; Case Code (Metric): 3225; Depth: 2.5mm; Construction: Flat; Max Operating Temperature: 85°C; Number of Pins: 2; Mount: Surface Mount; Lead Free: Lead Free; RoHS Compliant: Yes; Voltage Rating: 6.3V; Dielectric: X5R; Length: 3.2mm; Case Code (Imperial): 1210; Tolerance: 20%
D5 = CMP-00278-81858208-1: NSP4201MR6T1G TVS DIODE 5VWM 12VC 6TSOP; Manufacturer Lifecycle Status: ACTIVE; Direction: Unidirectional; Capacitance: 3pF; Max Junction Temperature (Tj): 125°C; Breakdown Voltage: 6V; Peak Pulse Current: 25A; Number of Channels: 4; Reverse Standoff Voltage: 5V; Peak Pulse Power: 500W; Clamping Voltage: 12V; NexarPartId: 81858208; Height: 1.1mm; Min Operating Temperature: -40°C; RoHS: Compliant; Max Operating Temperature: 125°C; Schedule B: 8536300000; Lifecycle Status: Production; ComponentLink1Description: New link; ComponentLink1URL: https://linhkien.cxtvn.com/4420-nsp4201mr6t1g-tvs-diode-5vwm-12vc-6tsop.html
J2 J3 = CMP-2000-05152-3: CONN U.FL RCPT STR 50 OHM SMD; Max Frequency: 6GHz; Connector Type: Coaxial; Body Plating: Silver; Body Material: Bronze; Impedance: 50R; Dielectric Material: Polymer; Insulation Resistance: 500MR; Gender: Male; Packaging: Cut Tape; Length: 3mm; Package Quantity: 2500; Termination: Solder; Lead Free: Lead Free; Series: U.FL; Min Operating Temperature: -40°C; Fastening Type: Snap; Contact Material: Brass; Orientation: Straight; Wire/Cable Type: Coaxial; Frequency: 6GHz; Contact Plating: Gold; Depth: 3.1mm; Weight: 0.001764oz; Max Operating Temperature: 90°C; Radiation Hardening: No; REACH SVHC: No SVHC; Mount: Surface Mount; Housing Color: Beige
Q4-Q6 = CMP-1670-00008-1: NPN General Purpose Amplifier, 40 V, 0.2 A, -55 to 150 degC, 3-Pin SOT23, RoHS, Tape and Reel; Tolerance: 30ppm; Capacitance: 1.8E-11 f; Frequency: 12.288 MHz; ESR: 40 Ohm; Load Capacitance: 18 pF; REACH SVHC: No SVHC; Pins: 4; ComponentLink3URL: http://www.fairchildsemi.com/dwg/MA/MA03D.pdf; PackageDescription: 3-Pin Small Outline Transistor, Body 2.92 x 1.325 mm, Pitch 0.95 mm; ComponentLink1URL: https://www.fairchildsemi.com/; Max Operating Temperature: 70degC; PackageReference: SOT23-3; ComponentLink1Description: Manufacturer URL; Width: 0.126 inch; Min Operating Temperature: -20degC; DatasheetVersion: Rev. 1.1.0, 10/2014; Mount: Surface Mount; Height: 0.041 inch; Package Quantity: 1000; Frequency Tolerance: 30ppm; Packaging: Tape and Reel; ComponentLink2URL: https://www.fairchildsemi.com/datasheets/MM/MMBT3904.pdf; RoHSCompliant: True; ComponentLink3Description: Package Specification; ComponentLink2Description: Datasheet; Length: 0.197 inch
Q7 Q8 = CMP-07173-000101-1: MOSFET N-CH 50V 220MA SOT-23; Turn-Off Delay Time: 20ns; Element Configuration: Single; Rds On Max: 3.5R; Gate to Source Voltage (Vgs): 20V; Threshold Voltage: 1.3V; Number of Elements: 1; Power Dissipation: 360mW; Rise Time: 9ns; Turn-On Delay Time: 2.5ns; Input Capacitance: 27pF; On-State Resistance: 6R; Lead Free: Lead Free; Length: 2.92mm; Width: 1.3mm; Drain to Source Breakdown Voltage: 50V; Min Operating Temperature: -55°C; REACH SVHC: No SVHC; Packaging: Tape and Reel; Radiation Hardening: No; Height: 0.93mm; Drain to Source Voltage (Vdss): 50V; Current Rating: 220mA; Voltage Rating (DC): 50V; Weight: 0.03g; Continuous Drain Current (ID): 220mA; Number of Pins: 3; Nominal Vgs: 1.3V; Max Power Dissipation: 360mW; Fall Time: 9ns; Drain to Source Resistance: 3.5R; Contact Plating: Tin; Case/Package: SOT-23; Package Quantity: 1; Dual Supply Voltage: 50V; Mount: Surface Mount; Termination: SMD/SMT; Max Operating Temperature: 150°C
R28 = Res-SMD: Res 0805 5%; Manufacturer: Generic Components; Class: Passive; Published: 08/06/2000; Publisher: Altium Hobart Technology Centre
R29 R30 R33 = Res-SMD: Res 0603 1%; Manufacturer: Generic Components; Class: Passive; Published: 08/06/2000; Publisher: Altium Hobart Technology Centre
R31 R32 R34-R51 = Res-SMD: as R53 on sheet PW; Published: 08/06/2000; Publisher: Altium Hobart Technology Centre
U7 = CMP-06324-000007-1: MIC29302WU IC REG LINEAR POS ADJ 3A TO263-5; Manufacturer: Microchip; Output Voltage: 3.3-12V; Output Type: AdjustableProgrammable; Max Junction Temp: +125°C; Standoff Height: 0mm; Accuracy Percentage: 1%; Max Supply Voltage: 26V; Nominal Supply Current: 10-37mA; Number Of Outputs: 1; Dropout Voltage: 370mV; Min Supply Voltage: 2.25V; ComponentLink2URL: http://ww1.microchip.com/downloads/en/DeviceDoc/MIC2915x-30x-50x-75x-High-Current-Low-Dropout-Regulators-DS20005685B.pdf; Device Class L1: Integrated Circuits (ICs); Digikey Description: IC REG LINEAR POS ADJ 3A TO263-5; Device Class L2: Power Management ICs; Lead Free: Yes; Mouser Description: LDO Voltage Regulators; Package: C04-012; Temperature: -40°C to +125°C; ComponentLink2Description: Datasheet; Temperature Range High: +125°C; Automotive: No; Device Class L3: Voltage Regulators - Linear; Category: IC; Temperature Range Low: -40°C; RoHS: TRUE; Output Current: 3A; Octopart: https://octopart.com/mic29302wu-tr-microchip-66801318; Manufacturer Part Number: MIC29302WU-TR; Height: 0.2inch; ComponentLink3Description: New link; ComponentLink3URL: https://linhkien.cxtvn.com/1277-mic29302wu-ic-reg-linear-pos-adj-3a-to263-5.html
J4 = MUP-C7801-2 Nano Sim Socket: ComponentLink1Description: New link; ComponentLink1URL: https://linhkien.cxtvn.com/9704-mup-c7801-2-socket-nano-sim-7p.html

## Sheet LCD.SchDoc
size 203 x 152 mm; SheetNumber: 13; SheetTotal: 15
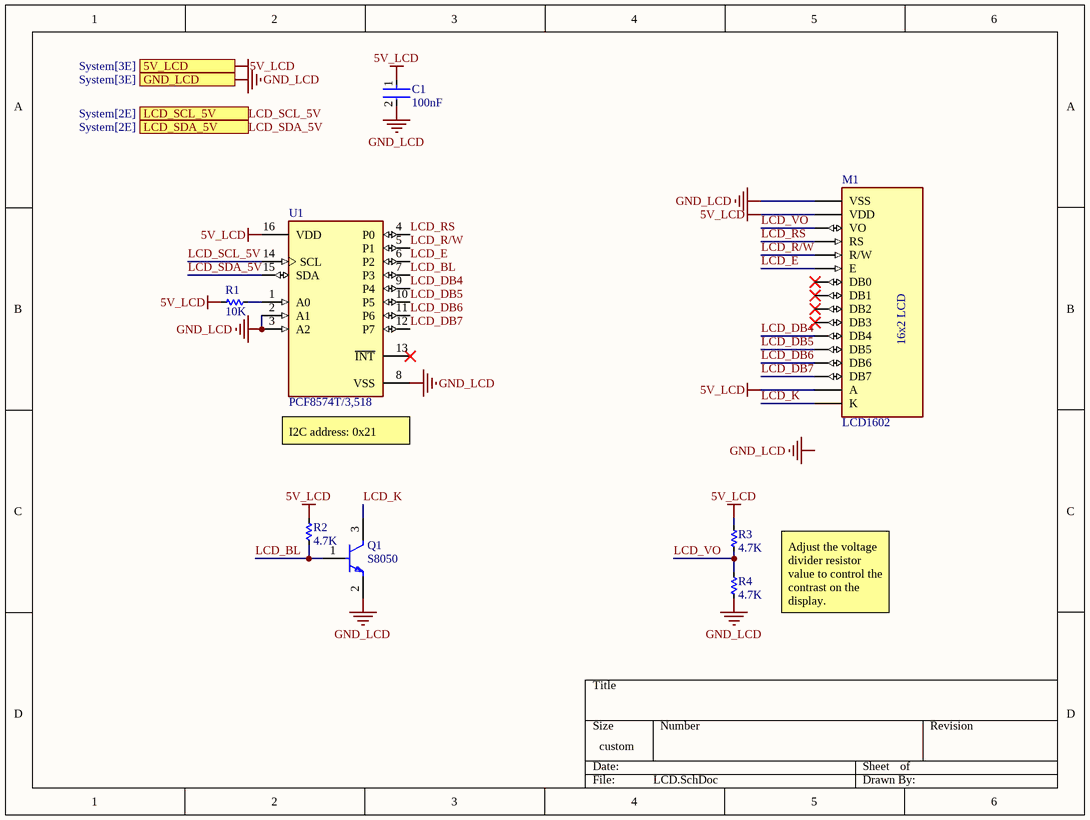
[diagram p13: LCD.SchDoc]

### Parts
C1  100nF  [FP-GRM18-0_15-MFG]
M1  LCD1602  [LCD1602']
Q1  S8050  [FP-SS8050-G-IPC_A]
R1  10K  [RES-SMD-0603]
R2  4.7K  [RES-SMD-0603]
R3  4.7K  [RES-SMD-0603]
R4  4.7K  [RES-SMD-0603]
U1  PCF8574T/3,518  [FP-SOT162-1-IPC_B]

### Ports
5V_LCD (see System[3E]), GND_LCD (see System[3E]), LCD_SCL_5V (see System[2E]), LCD_SDA_5V (see System[2E])

### Nets
5V_LCD: C1.1 M1.2(VDD) M1.15(A) R1.2 R2.1 R3.1 U1.16(VDD) ; port 5V_LCD  [project net 5V]
GND_LCD: C1.2 M1.1(VSS) Q1.2(E) R4.2 U1.2(A1) U1.3(A2) U1.8(VSS) ; port GND_LCD  [project net GND]
LCD_BL: Q1.1(B) R2.2 U1.7(P3)
LCD_DB4: M1.11(DB4) U1.9(P4)
LCD_DB5: M1.12(DB5) U1.10(P5)
LCD_DB6: M1.13(DB6) U1.11(P6)
LCD_DB7: M1.14(DB7) U1.12(P7)
LCD_E: M1.6(E) U1.6(P2)
LCD_K: M1.16(K) Q1.3(C)
LCD_R/W: M1.5(R/W) U1.5(P1)
LCD_RS: M1.4(RS) U1.4(P0)
LCD_SCL_5V: U1.14(SCL) ; port LCD_SCL_5V  [project net AI_SCL_5V]
LCD_SDA_5V: U1.15(SDA) ; port LCD_SDA_5V  [project net AI_SDA_5V]
LCD_VO: M1.3(VO) R3.2 R4.1
NetR1_1: R1.1 U1.1(A0)

Not connected (* = marked no-connect by the designer): M1 7(DB0)* 8(DB1)* 9(DB2)* 10(DB3)*; U1 13(~{INT})*

### Notes on the sheet
- (near U1) I2C address: 0x21
- Adjust the voltage divider resistor value to control the contrast on the display.
- Labels drawn without touching a wire or pin: GND_LCD
- (in symbol LCD1602) 16x2 LCD

### Library data of the parts
C1 = CMP-2000-05448-2: CAP CER 104 0603; Manufacturer Part Number: GRM188R61A106KE69D; Manufacturer: Murata; Temperature Coefficient: 15%; Value: 10uF; Temperature Characteristic: X5R; Material: Ceramic; Tolerance: 10%; Voltage Rating: 10V; Device Class L1: Passive Components; ComponentLink2Description: Datasheet; Height: 0.95mm; Package: GRM18-0.15; Octopart: https://octopart.com/grm188r61a106ke69d-murata-22851381; Digikey Description: CAP CER 10UF 10V X5R 0603; Temperature Range High: +85°C; Temperature Range Low: -55°C; Capacitance: 10uF; RoHS: TRUE; Device Class L2: Capacitors; ComponentLink2URL: https://search.murata.co.jp/Ceramy/image/img/A01X/G101/ENG/GRM188R61A106KE69-01A.pdf; Device Class L3: Ceramic Capacitors; Lead Free: Yes; Mouser Description: Multilayer Ceramic Capacitors MLCC - SMD/SMT 0603 10uF 10volts X5R + - 10%; Category: Cap; Temperature: -55°C to +85°C; Automotive: No
Q1 = CMP-20235-000001-1: S8050 J3Y MBT8050LT1G NPN Transistor 0.5A 40V SOT-23; Max Collector Current: 1.5A; Transition Frequency: 100MHz; Max Breakdown Voltage: 25V; Collector Emitter Voltage (VCEO): 400mV; Max Power Dissipation: 300mW; Case/Package: TO-236-3; Packaging: Tape and Reel; RoHS Compliant: Yes; Mount: Surface Mount; Collector Emitter Breakdown Voltage: 25V
R1-R4 = Res-SMD: as R53 on sheet PW; Published: 08/06/2000; Publisher: Altium Hobart Technology Centre
U1 = CMP-10112-000010-1: IC I/O EXPANDER I2C 8B 16SOIC; Manufacturer: NXP Semiconductors; Frequency: 100kHz; Max Supply Voltage: 6V; Standoff Height: 0.1mm; Nominal Supply Current: 40uA; Max Junction Temp: +125°C; Min Supply Voltage: 2.5V; Number Of I/Os: 8; Manufacturer Part Number: PCF8574T/3,518; Footprint Url: https://www.nxp.com/docs/en/package-information/SOT162-1.pdf; ComponentLink2URL: https://www.nxp.com/docs/en/data-sheet/PCF8574_PCF8574A.pdf; Automotive: No; Digikey Description: IC I/O EXPANDER I2C 8B 16SOIC; Mouser Description: PCF8574 Series 2.5 - 6V Remote 8-bit I/O Expander for I2C-bus - SOIC-16; Ipc Land Pattern Name: SOIC127P1032X265-16; Interface: I2C; Octopart: https://octopart.com/pcf8574t%2F3%2C518-nxp+semiconductors-10470852; Ambient Temperature Range Low: -40°C; Lead Free: Yes; Device Class L2: Interface ICs; Temperature Range High: +85°C; Device Class L1: Integrated Circuits (ICs); Package: SOT162-1; ComponentLink2Description: Datasheet; Device Class L3: I/O Expanders; Temperature: -40°C to +85°C; Ambient Temperature Range High: +85°C; Height: 2.65mm; Category: IC; RoHS: TRUE; Temperature Range Low: -40°C

## Sheet LED.SchDoc
size A4; SheetNumber: 7; SheetTotal: 15
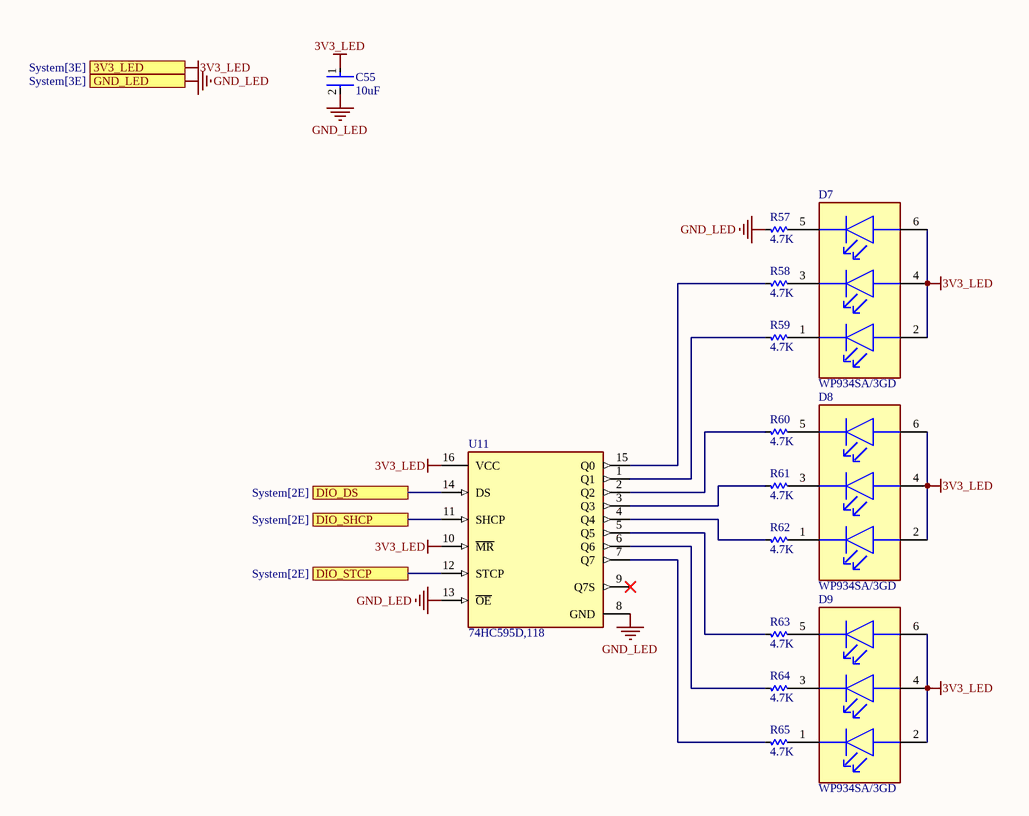
[diagram p14: LED.SchDoc]

### Parts
C55  10uF  [FP-CC0603-DA-IPC_B]
D7  WP934SA/3GD  [FP-WP934SA-3GD-MFG]
D8  WP934SA/3GD  [FP-WP934SA-3GD-MFG]
D9  WP934SA/3GD  [FP-WP934SA-3GD-MFG]
R57  4.7K  [RES-SMD-0603]
R58  4.7K  [RES-SMD-0603]
R59  4.7K  [RES-SMD-0603]
R60  4.7K  [RES-SMD-0603]
R61  4.7K  [RES-SMD-0603]
R62  4.7K  [RES-SMD-0603]
R63  4.7K  [RES-SMD-0603]
R64  4.7K  [RES-SMD-0603]
R65  4.7K  [RES-SMD-0603]
U11  74HC595D,118  [FP-SOT109-1-IPC_A]

### Ports
3V3_LED (see System[3E]), DIO_DS (see System[2E]), DIO_SHCP (see System[2E]), DIO_STCP (see System[2E]), GND_LED (see System[3E])

### Nets
3V3_LED: C55.1 D7.2(1_ANODE) D7.4(2_ANODE) D7.6(3_ANODE) D8.2(1_ANODE) D8.4(2_ANODE) D8.6(3_ANODE) D9.2(1_ANODE) D9.4(2_ANODE) D9.6(3_ANODE) U11.10(~{MR}) U11.16(VCC) ; port 3V3_LED  [project net 3V3]
GND_LED: C55.2 R57.2 U11.8(GND) U11.13(~{OE}) ; port GND_LED  [project net GND]
NetD7_1: D7.1(1_CATHODE) R59.1
NetD7_3: D7.3(2_CATHODE) R58.1
NetD7_5: D7.5(3_CATHODE) R57.1
NetD8_1: D8.1(1_CATHODE) R62.1
NetD8_3: D8.3(2_CATHODE) R61.1
NetD8_5: D8.5(3_CATHODE) R60.1
NetD9_1: D9.1(1_CATHODE) R65.1
NetD9_3: D9.3(2_CATHODE) R64.1
NetD9_5: D9.5(3_CATHODE) R63.1
NetR58_2: R58.2 U11.15(Q0)
NetR59_2: R59.2 U11.1(Q1)
NetR60_2: R60.2 U11.2(Q2)
NetR61_2: R61.2 U11.3(Q3)
NetR62_2: R62.2 U11.4(Q4)
NetR63_2: R63.2 U11.5(Q5)
NetR64_2: R64.2 U11.6(Q6)
NetR65_2: R65.2 U11.7(Q7)
NetU11_11: U11.11(SHCP) ; port DIO_SHCP
NetU11_12: U11.12(STCP) ; port DIO_STCP
NetU11_14: U11.14(DS) ; port DIO_DS

Not connected (* = marked no-connect by the designer): U11 9(Q7S)*

### Library data of the parts
C55 = CMP-2000-05002-2: CAP CER X7R 0603; Manufacturer Part Number: CC0603KRX7R7BB104; Manufacturer: YAGEO; Voltage Rating: 16 V; Tolerance: 0.1; Value: 100 nF; Temperature Coefficient: 15%; Material: Ceramic; Package: CC0603-DA; ComponentLink2Description: Datasheet; Octopart: https://octopart.com/cc0603krx7r7bb104-yageo-192941; Temperature Range High: +125°C; Digikey Description: CAP CER 0.1UF 16V X7R 0603; Voltage: 16 V; Device Class L2: Capacitors; Height: 0.9mm; Temperature: -55°C to +125°C; Device Class L1: Passive Components; Device Class L3: Ceramic Capacitors; ComponentLink2URL: http://www.yageo.com/documents/recent/UPY-GPHC_X7R_6.3V-to-50V_18.pdf; Footprint Url: http://www.yageo.com/exep/pages/download/literatures/UPY-C_GEN_24.pdf; RoHS: TRUE; Temperature Range Low: -55°C; Temperature Characteristic: X7R; Lead Free: Yes; Capacitance: 100 nF; Category: Cap; Mouser Description: Multilayer Ceramic Capacitor, CC Series, 0.1 - F, - 10%, X7R, 16 V, 0603 [1608 Metric]; Automotive: No
D7-D9 = CMP-44529-000026-1: LED IND 3MM TRI-LVL RA GRN DIFF; Illumination Color: Green; Forward Current: 20mA; Viewing Angle: 40°; Luminous Intensity: 20mcd; Voltage Rating: 2.2V; Wavelength: 568nm; Lens Style: Diffused; Mount: Through Hole; Current: 20mA; Forward Voltage: 2.2V; Color: Green; Package Quantity: 125; Lens Color: Green; Packaging: Rail/Tube; Lead Free: Lead Free
R57-R65 = Res-SMD: as R53 on sheet PW; Published: 08/06/2000; Publisher: Altium Hobart Technology Centre
U11 = CMP-14351-000006-1: IC SHIFT REGISTER 8BIT 16SOIC; RoHS Compliant: Yes

## Sheet DIO.SchDoc
size A4; SheetNumber: 8; SheetTotal: 15
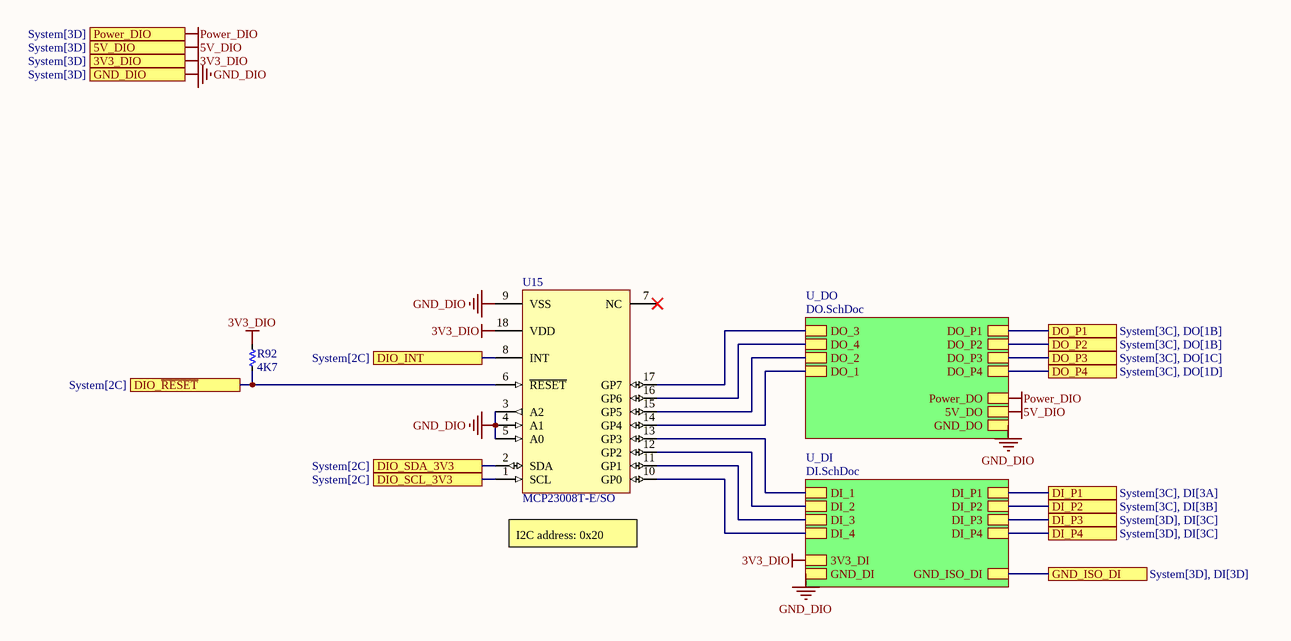
[diagram p15: DIO.SchDoc]

### Parts
R92  4K7  [RES-SMD-0603]
U15  MCP23008T-E/SO  [SOIC-SO18_N]

### Sub-sheets
U_DI = DI.SchDoc: DI_1, DI_2, DI_3, DI_4, 3V3_DI, GND_DI, DI_P1, DI_P3, DI_P4, DI_P2, GND_ISO_DI
U_DO = DO.SchDoc: 5V_DO, GND_DO, Power_DO, DO_4, DO_3, DO_2, DO_1, DO_P4, DO_P1, DO_P3, DO_P2

### Ports
3V3_DIO (see System[3D]), 5V_DIO (see System[3D]), DI_P1 (see System[3C], DI[3A]), DI_P2 (see System[3C], DI[3B]), DI_P3 (see System[3D], DI[3C]), DI_P4 (see System[3D], DI[3C]), DIO_INT (see System[2C]), DIO_SCL_3V3 (see System[2C]), DIO_SDA_3V3 (see System[2C]), DIO_~{RESET} (see System[2C]), DO_P1 (see System[3C], DO[1B]), DO_P2 (see System[3C], DO[1B]), DO_P3 (see System[3C], DO[1C]), DO_P4 (see System[3C], DO[1D]), GND_DIO (see System[3D]), GND_ISO_DI (see System[3D], DI[3D]), Power_DIO (see System[3D])

### Nets
3V3_DIO: R92.2 U15.18(VDD) ; port 3V3_DIO, sheet U_DI/3V3_DI  [project net 3V3]
5V_DIO: port 5V_DIO, sheet U_DO/5V_DO  [project net 5V]
GND_DIO: U15.3(A2) U15.4(A1) U15.5(A0) U15.9(VSS) ; port GND_DIO, sheet U_DO/GND_DO, sheet U_DI/GND_DI  [project net GND]
GND_ISO_DI: port GND_ISO_DI, sheet U_DI/GND_ISO_DI
Power_DIO: port Power_DIO, sheet U_DO/Power_DO  [project net Power+]
AI_SCL_3V3: U15.1(SCL) ; port DIO_SCL_3V3
AI_SDA_3V3: U15.2(SDA) ; port DIO_SDA_3V3
NetD10_2: port DO_P1, sheet U_DO/DO_P1
NetD12_2: port DO_P2, sheet U_DO/DO_P2
NetD14_2: port DO_P3, sheet U_DO/DO_P3
NetD16_2: port DO_P4, sheet U_DO/DO_P4
NetDIBF_D1_2: port DI_P1, sheet U_DI/DI_P1
NetDIBF_D2_2: port DI_P2, sheet U_DI/DI_P2
NetDIBF_D3_2: port DI_P3, sheet U_DI/DI_P3
NetDIBF_D4_2: port DI_P4, sheet U_DI/DI_P4
NetDIBF_R2_1: U15.13(GP3) ; sheet U_DI/DI_1
NetDIBF_R4_1: U15.12(GP2) ; sheet U_DI/DI_2
NetDIBF_R6_1: U15.11(GP1) ; sheet U_DI/DI_3
NetDIBF_R8_1: U15.10(GP0) ; sheet U_DI/DI_4
NetR70_1: U15.14(GP4) ; sheet U_DO/DO_1
NetR73_1: U15.15(GP5) ; sheet U_DO/DO_2
NetR76_1: U15.17(GP7) ; sheet U_DO/DO_3
NetR79_1: U15.16(GP6) ; sheet U_DO/DO_4
NetR92_1: R92.1 U15.6(~{RESET}) ; port DIO_~{RESET}
NetU14_24: U15.8(INT) ; port DIO_INT

Not connected (* = marked no-connect by the designer): U15 7(NC)*

### Notes on the sheet
- (near U15) I2C address: 0x20

### Library data of the parts
R92 = Res-SMD: as R53 on sheet PW; Published: 08/06/2000; Publisher: Altium Hobart Technology Centre
U15 = CMP-0186-00152-2: 8-Bit I/O Expander with Serial Interface, 18-Pin SOIC, Extended Temperature, Tape and Reel; ComponentLink1Description: Manufacturer URL; ComponentLink3Description: Package Specification; PackageReference: SOIC-SO18; RevisionNote: URLs added.; Code_JEDEC: MS-013; ComponentLink1URL: http://www.microchip.com/; DatasheetVersion: revE, Aug-2007; PackageVersion: revBB, Aug-2009; ComponentLink2URL: http://ww1.microchip.com/downloads/en/DeviceDoc/21919e.pdf; ComponentLink3URL: http://www.microchip.com/stellent/groups/techpub_sg/documents/packagingspec/en012702.pdf; PackageDescription: 18-Lead Plastic Small Outline (SO) - Wide 7.50mm Body [SOIC]; ComponentLink2Description: Datasheet